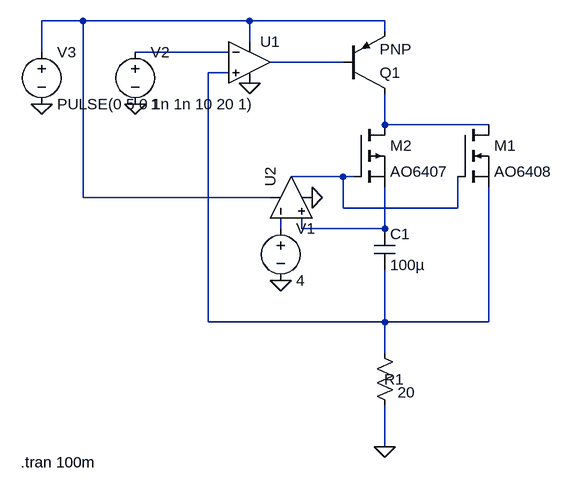
[diagram p0: schematic Circuit Qual.asc]
Circuit Qual.asc, the LTspice schematic file:
Version 4
SHEET 1 880 680
WIRE -208 -176 -272 -176
WIRE 48 -176 -208 -176
WIRE 256 -176 48 -176
WIRE 256 -160 256 -176
WIRE 48 -144 48 -176
WIRE -272 -128 -272 -176
WIRE 16 -128 -128 -128
WIRE 192 -112 80 -112
WIRE 16 -96 -16 -96
WIRE 256 -16 256 -64
WIRE 416 -16 256 -16
WIRE 192 64 112 64
WIRE 208 64 192 64
WIRE -208 96 -208 -176
WIRE 80 96 -208 96
WIRE 192 112 192 64
WIRE 368 112 368 64
WIRE 368 112 192 112
WIRE 96 144 96 128
WIRE 128 144 128 128
WIRE 256 144 256 80
WIRE 256 144 128 144
WIRE -16 288 -16 -96
WIRE 256 288 256 208
WIRE 256 288 -16 288
WIRE 416 288 416 80
WIRE 416 288 256 288
WIRE 256 336 256 288
WIRE 256 480 256 416
FLAG 256 480 0
FLAG -128 -48 0
FLAG -272 -48 0
FLAG 48 -80 0
FLAG 144 96 0
FLAG 96 224 0
SYMBOL pnp 192 -64 M180
SYMATTR InstName Q1
SYMBOL nmos 368 -16 R0
SYMATTR InstName M1
SYMATTR Value AO6408
SYMBOL pmos 208 -16 R0
SYMATTR InstName M2
SYMATTR Value AO6407
SYMBOL cap 240 144 R0
SYMATTR InstName C1
SYMATTR Value 100µ
SYMBOL res 240 320 R0
WINDOW 0 15 56 Left 2
SYMATTR InstName R1
SYMATTR Value 20
SYMBOL voltage 96 128 R0
WINDOW 123 0 0 Left 2
WINDOW 39 0 0 Left 2
SYMATTR InstName V1
SYMATTR Value 4
SYMBOL voltage -128 -144 R0
WINDOW 123 0 0 Left 2
WINDOW 39 0 0 Left 2
SYMATTR InstName V2
SYMATTR Value 1
SYMBOL voltage -272 -144 R0
WINDOW 123 0 0 Left 2
WINDOW 39 0 0 Left 2
SYMATTR InstName V3
SYMATTR Value PULSE(0 5 0 1n 1n 10 20 1)
SYMBOL Opamps\\UniversalOpamp2 48 -112 R0
SYMATTR InstName U1
SYMATTR SpiceLine ilimit=5m rail=0 Vos=0 phimargin=45
SYMBOL Opamps\\UniversalOpamp2 112 96 R270
SYMATTR InstName U2
SYMATTR SpiceLine ilimit=5m rail=0 Vos=0 phimargin=45
TEXT -304 504 Left 2 !.tran 100m

The netlist it stands for:
* Circuit Qual.asc
Q1 N005 N003 N001 0 PNP
M1 N005 N006 N004 N004 AO6408
M2 N005 N006 N008 N008 AO6407
C1 N008 N004 100µ
R1 N004 0 20
V1 N007 0 4
V2 N002 0 1
V3 N001 0 PULSE(0 5 0 1n 1n 10 20 1)
XU1 N004 N002 N001 0 N003 level.2 Avol=1Meg GBW=10Meg Slew=10Meg ilimit=5m rail=0 Vos=0 phimargin=45 en=0 enk=0 in=0 ink=0 Rin=500Meg  ; pins IN+ IN- V+ V- OUT
XU2 N008 N007 N001 0 N006 level.2 Avol=1Meg GBW=10Meg Slew=10Meg ilimit=5m rail=0 Vos=0 phimargin=45 en=0 enk=0 in=0 ink=0 Rin=500Meg  ; pins IN+ IN- V+ V- OUT
.model NPN NPN
.model PNP PNP
.lib standard.bjt
.model NMOS NMOS
.model PMOS PMOS
.lib standard.mos
.tran 100m
.lib UniversalOpamps2.sub
.backanno
.end